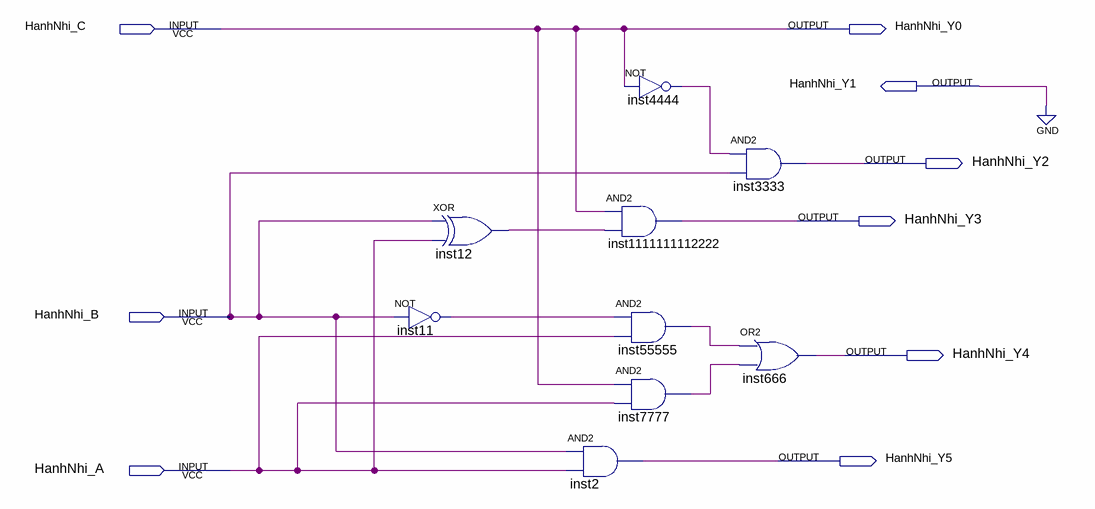
[diagram p0: schematic sheet]
// Quartus schematic Assignment5.bdf as structural Verilog: 9 symbols, 9 pins
module Assignment5 (
  input  HanhNhi_C,
  input  HanhNhi_B,
  input  HanhNhi_A,
  output HanhNhi_Y0,
  output HanhNhi_Y1,
  output HanhNhi_Y2,
  output HanhNhi_Y3,
  output HanhNhi_Y4,
  output HanhNhi_Y5
);

  wire inst11_out, inst12_out, inst4444_out, inst7777_out, inst55555_out;

  not inst11 (inst11_out, HanhNhi_B);
  xor inst12 (inst12_out, HanhNhi_B, HanhNhi_A);
  and inst2 (HanhNhi_Y5, HanhNhi_B, HanhNhi_A);
  not inst4444 (inst4444_out, HanhNhi_C);
  and inst1111111112222 (HanhNhi_Y3, HanhNhi_C, inst12_out);
  and inst55555 (inst55555_out, inst11_out, HanhNhi_A);
  and inst7777 (inst7777_out, HanhNhi_C, HanhNhi_A);
  and inst3333 (HanhNhi_Y2, inst4444_out, HanhNhi_B);
  or inst666 (HanhNhi_Y4, inst55555_out, inst7777_out);

  assign HanhNhi_Y0 = HanhNhi_C;
  assign HanhNhi_Y1 = 1'b0;
endmodule
